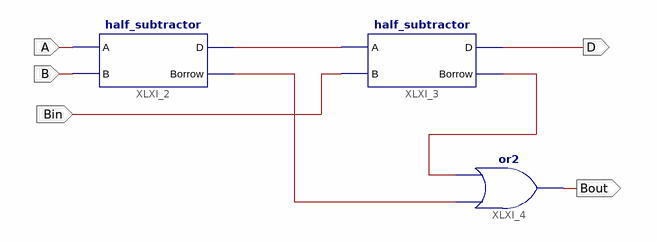
[diagram p0: schematic sheet 1]
// Xilinx ISE schematic full_subtractor.sch (artix7) as structural Verilog: 3 symbols, 5 ports
module full_subtractor (
  input  Bin,
  input  A,
  input  B,
  output D,
  output Bout
);

  wire XLXN_1, XLXN_2, XLXN_3;

  half_subtractor XLXI_2 (.A(A), .B(B), .D(XLXN_1), .Borrow(XLXN_2));
  half_subtractor XLXI_3 (.A(XLXN_1), .B(Bin), .D(D), .Borrow(XLXN_3));
  or XLXI_4 (Bout, XLXN_2, XLXN_3);
endmodule
